# Altium schematic sheet Cannon_V2.SchDoc
size A3
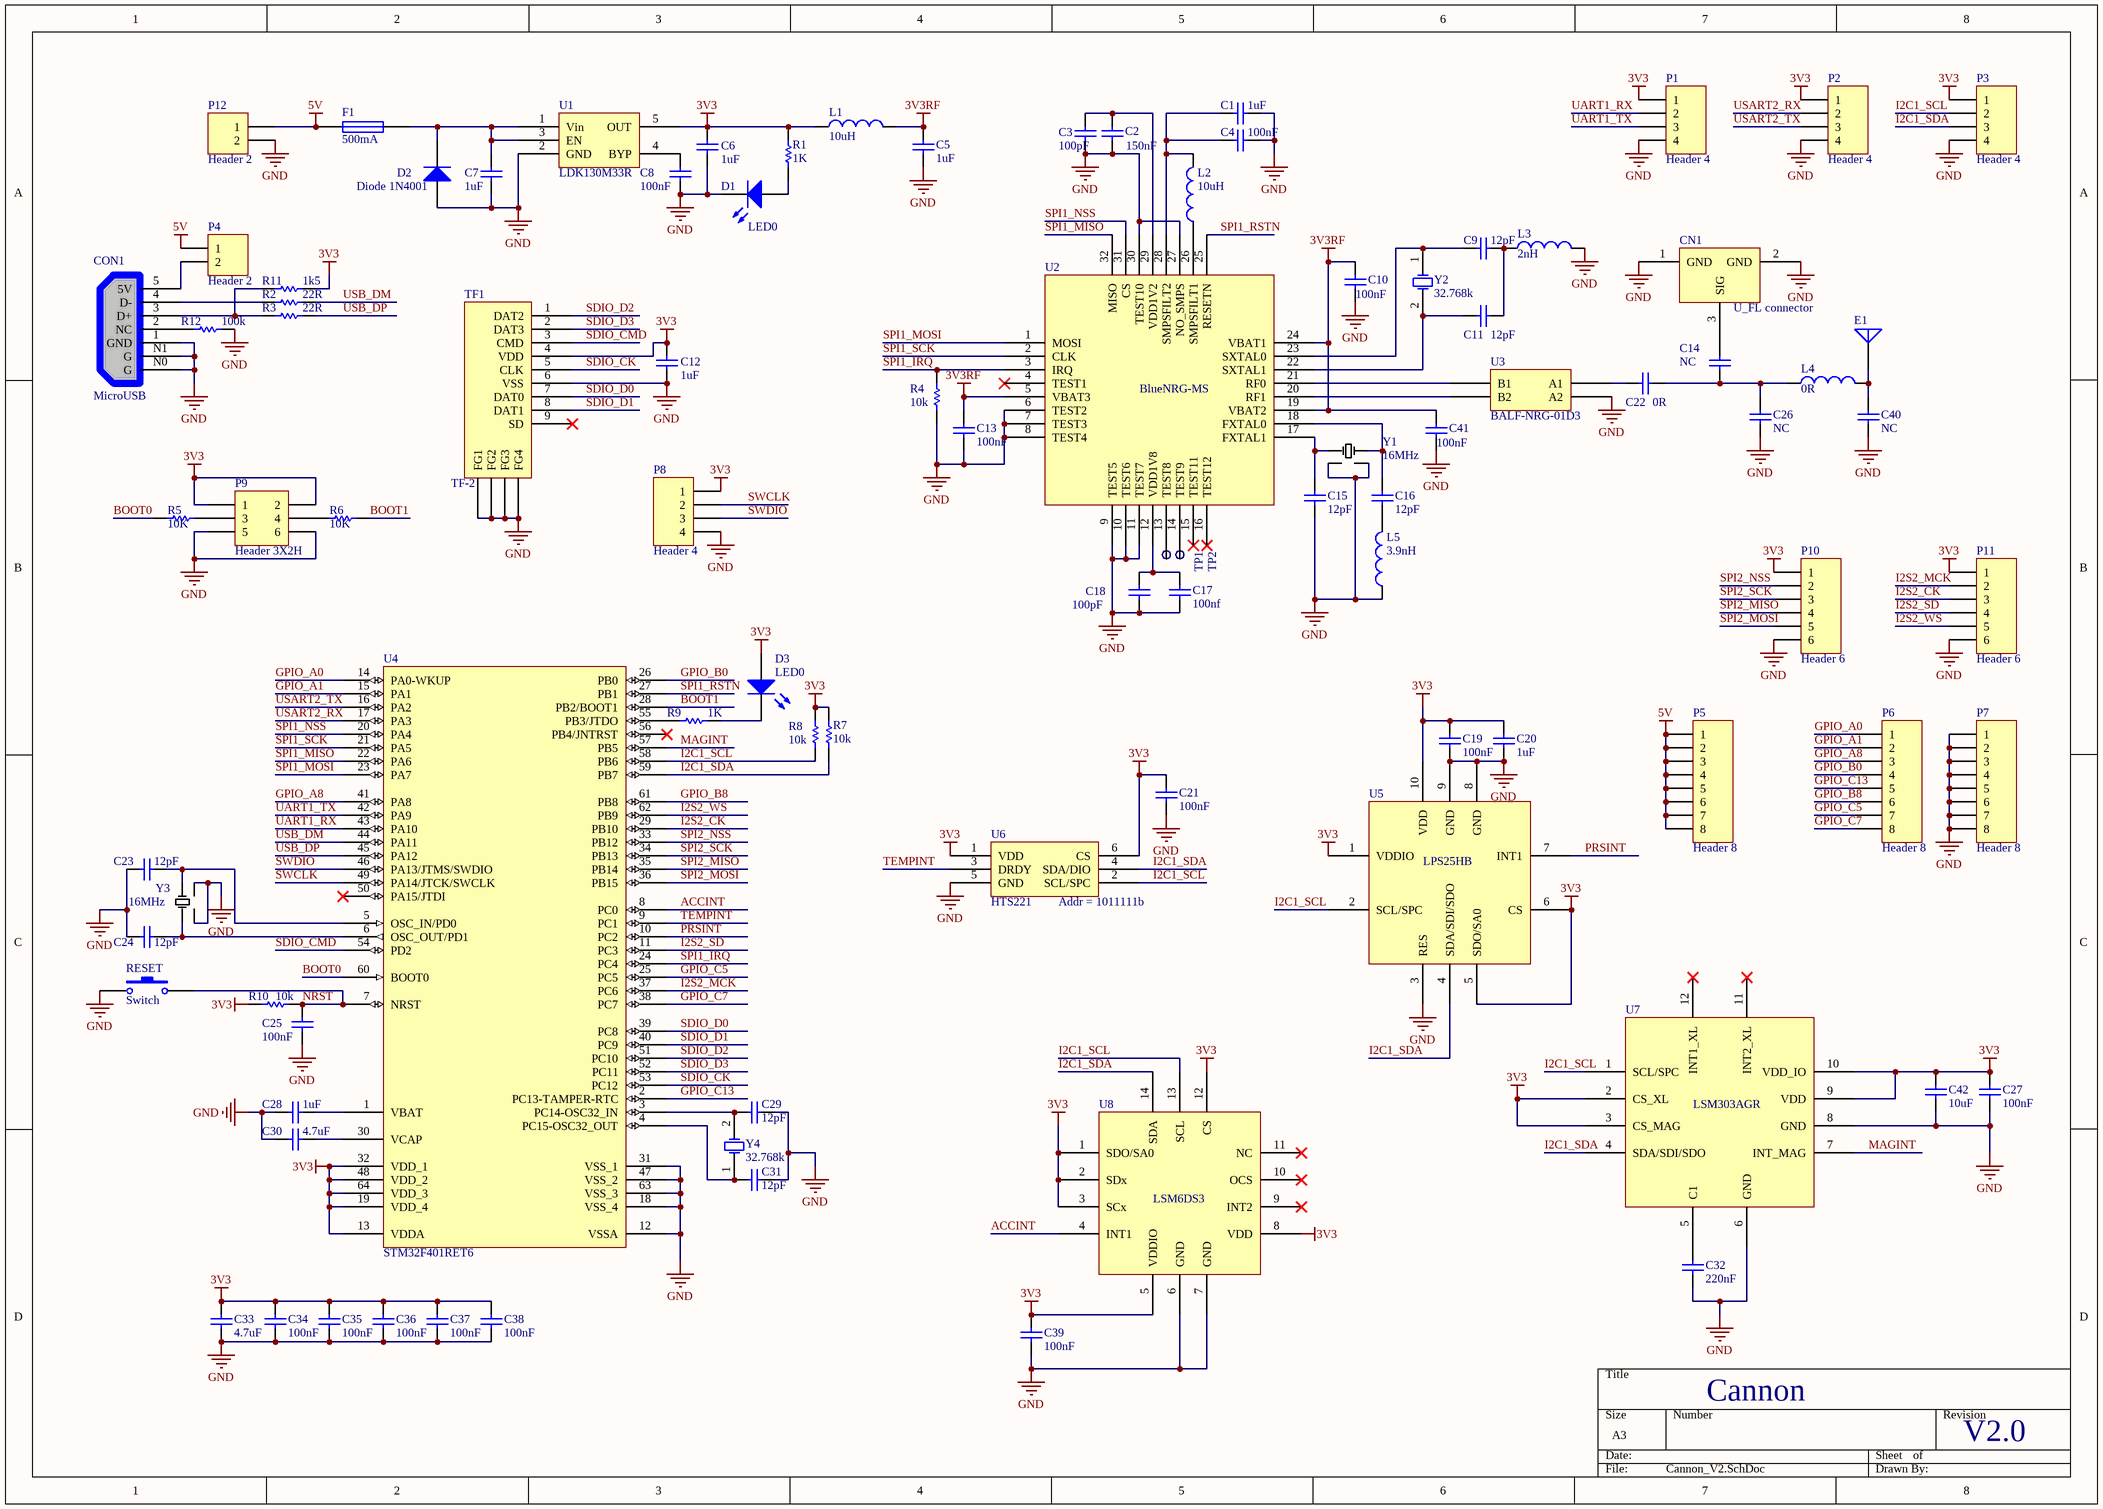
[diagram p0: Cannon_V2.SchDoc]

## Parts
C1  1uF  [CAPC1608X06L]
C2  150nF  [CAPC1005X04L]
C3  100pF  [CAPC1005X04L]
C4  100nF  [CAPC1005X04L]
C5  1uF  [CAPC1608X06L]
C6  1uF  [CAPC1608X06L]
C7  1uF  [CAPC1608X06L]
C8  100nF  [CAPC1005X04L]
C9  12pF  [CAPC1005X04L]
C10  100nF  [CAPC1005X04L]
C11  12pF  [CAPC1005X04L]
C12  1uF  [CAPC1608X06L]
C13  100nF  [CAPC1005X04L]
C14  NC  [CAPC1005X04L]
C15  12pF  [CAPC1005X04L]
C16  12pF  [CAPC1005X04L]
C17  100nf  [CAPC1005X04L]
C18  100pF  [CAPC1005X04L]
C19  100nF  [CAPC1005X04L]
C20  1uF  [CAPC1608X06L]
C21  100nF  [CAPC1005X04L]
C22  0R  [CAPC1005X04L]
C23  12pF  [CAPC1005X04L]
C24  12pF  [CAPC1005X04L]
C25  100nF  [CAPC1005X04L]
C26  NC  [CAPC1005X04L]
C27  100nF  [CAPC1005X04L]
C28  1uF  [CAPC1608X06L]
C29  12pF  [CAPC1005X04L]
C30  4.7uF  [CAPC1608X06L]
C31  12pF  [CAPC1005X04L]
C32  220nF  [CAPC1005X04L]
C33  4.7uF  [CAPC1608X06L]
C34  100nF  [CAPC1005X04L]
C35  100nF  [CAPC1005X04L]
C36  100nF  [CAPC1005X04L]
C37  100nF  [CAPC1005X04L]
C38  100nF  [CAPC1005X04L]
C39  100nF  [CAPC1005X04L]
C40  NC  [CAPC1005X04L]
C41  100nF  [CAPC1005X04L]
C42  10uF  [CAPC1608X06L]
CN1  U_FL connector  [UFL]
CON1  MicroUSB  [Micro_USB]
D1  LED0  [INDC1608L]
D2  Diode 1N4001  [SOD323]
D3  LED0  [INDC1608L]
E1  Antenna  [INDM9621X21N]  (value not drawn)
F1  500mA  [6-0805_N]
L1  10uH  [INDC1608X06L]
L2  10uH  [INDC1608X06L]
L3  2nH  [INDC1005X04L]
L4  0R  [INDC1005X04L]
L5  3.9nH  [INDC1005X04L]
P1  Header 4  [HDR1X4]
P2  Header 4  [HDR1X4]
P3  Header 4  [HDR1X4]
P4  Header 2  [HDR1X2]
P5  Header 8  [HDR1X8]
P6  Header 8  [HDR1X8]
P7  Header 8  [HDR1X8]
P8  Header 4  [HDR1X4]
P9  Header 3X2H  [HDR2X3]
P10  Header 6  [HDR1X6]
P11  Header 6  [HDR1X6]
P12  Header 2  [SIP_2]
R1  1K  [INDC1005X04L]
R2  22R  [INDC1005X04L]
R3  22R  [INDC1005X04L]
R4  10k  [INDC1005X04L]
R5  10K  [INDC1005X04L]
R6  10K  [INDC1005X04L]
R7  10k  [INDC1005X04L]
R8  10k  [INDC1005X04L]
R9  1K  [INDC1005X04L]
R10  10k  [INDC1005X04L]
R11  1k5  [INDC1005X04L]
R12  100k  [INDC1005X04L]
RESET  Switch  [SW_THT_4x4x1.5]
TF1  TF-2  [TF-2]
TP1  TP  [TP-1x1]  (value not drawn)
TP2  TP  [TP-1x1]  (value not drawn)
U1  LDK130M33R  [SOT23-5L]
U2  BlueNRG-MS  [QFN32]
U3  BALF-NRG-01D3  [BALF-PK]
U4  STM32F401RET6  [LQFP64_N]
U5  LPS25HB  [HLGA-10L]
U6  HTS221  [HLGA-6L]
U7  LSM303AGR  [LGA12]
U8  LSM6DS3  [LGA-14L]
Y1  16MHz  [3225]
Y2  32.768k  [XTAL_3215]
Y3  16MHz  [3225]
Y4  32.768k  [XTAL_3215]

## Nets
3V3: C6.2 C12.2 C19.2 C20.1 C21.2 C27.1 C33.2 C34.1 C35.1 C36.1 C37.1 C38.1 C39.1 C42.1 D3.2(A) L1.1 P1.1 P2.1 P3.1 P8.1 P9.1 P9.2 P10.1 P11.1 R1.1 R7.1 R8.1 R10.2 R11.2 TF1.4(VDD) U1.5(OUT) U4.13(VDDA) U4.19(VDD_4) U4.32(VDD_1) U4.48(VDD_2) U4.64(VDD_3) U5.1(VDDIO) U5.5(SDO/SA0) U5.6(CS) U5.10(VDD) U6.1(VDD) U6.6(CS) U7.2(CS_XL) U7.3(CS_MAG) U7.9(VDD) U7.10(VDD_IO) U8.1(SDO/SA0) U8.2(SDx) U8.3(SCx) U8.5(VDDIO) U8.8(VDD) U8.12(CS)
3V3RF: C5.1 C10.1 C13.1 C41.1 L1.2 U2.5(VBAT3) U2.19(VBAT2) U2.24(VBAT1)
5V: F1.2 P4.1 P5.1 P5.2 P5.3 P5.4 P5.5 P5.6 P5.7 P5.8 P12.1
GND: C1.2 C2.2 C3.2 C4.2 C5.2 C6.1 C7.1 C8.1 C10.2 C12.1 C13.2 C15.2 C17.2 C18.2 C19.1 C20.2 C21.1 C23.2 C24.2 C25.1 C26.1 C27.2 C28.2 C29.1 C30.2 C31.1 C32.1 C33.1 C34.2 C35.2 C36.2 C37.2 C38.2 C39.2 C40.1 C41.2 C42.2 CN1.1(GND) CN1.2(GND) CON1.1(GND) CON1.N0(G) CON1.N1(G) D1.1(K) D2.1(A) L3.2 L5.1 P1.4 P2.4 P3.4 P7.1 P7.2 P7.3 P7.4 P7.5 P7.6 P7.7 P7.8 P8.4 P9.5 P9.6 P10.6 P11.6 P12.2 R4.2 R12.2 RESET.1 TF1.6(VSS) TF1.FG1 TF1.FG2 TF1.FG3 TF1.FG4 U1.2(GND) U2.6(TEST2) U2.7(TEST3) U2.8(TEST4) U2.9(TEST5) U2.10(TEST6) U2.11(TEST7) U2.27(NO_SMPS) U2.30(TEST10) U3.A2 U4.12(VSSA) U4.18(VSS_4) U4.31(VSS_1) U4.47(VSS_2) U4.63(VSS_3) U5.3(RES) U5.8(GND) U5.9(GND) U6.5(GND) U7.6(GND) U7.8(GND) U8.6(GND) U8.7(GND) Y1.2 Y1.4 Y3.2 Y3.4
ACCINT: U4.8(PC0) U8.4(INT1)
BOOT0: R5.1 U4.60(BOOT0)
BOOT1: R6.2 U4.28(PB2/BOOT1)
GPIO_A0: P6.1 U4.14(PA0-WKUP)
GPIO_A1: P6.2 U4.15(PA1)
GPIO_A8: P6.3 U4.41(PA8)
GPIO_B0: P6.4 U4.26(PB0)
GPIO_B8: P6.6 U4.61(PB8)
GPIO_C5: P6.7 U4.25(PC5)
GPIO_C7: P6.8 U4.38(PC7)
GPIO_C13: P6.5 U4.2(PC13-TAMPER-RTC)
I2C1_SCL: P3.2 R8.2 U4.58(PB6) U5.2(SCL/SPC) U6.2(SCL/SPC) U7.1(SCL/SPC) U8.13(SCL)
I2C1_SDA: P3.3 R7.2 U4.59(PB7) U5.4(SDA/SDI/SDO) U6.4(SDA/DIO) U7.4(SDA/SDI/SDO) U8.14(SDA)
I2S2_CK: P11.3 U4.29(PB10)
I2S2_MCK: P11.2 U4.37(PC6)
I2S2_SD: P11.4 U4.11(PC3)
I2S2_WS: P11.5 U4.62(PB9)
MAGINT: U4.57(PB5) U7.7(INT_MAG)
NRST: C25.2 R10.1 RESET.2 U4.7(NRST)
PRSINT: U4.10(PC2) U5.7(INT1)
SDIO_CK: TF1.5(CLK) U4.53(PC12)
SDIO_CMD: TF1.3(CMD) U4.54(PD2)
SDIO_D0: TF1.7(DAT0) U4.39(PC8)
SDIO_D1: TF1.8(DAT1) U4.40(PC9)
SDIO_D2: TF1.1(DAT2) U4.51(PC10)
SDIO_D3: TF1.2(DAT3) U4.52(PC11)
SPI1_IRQ: R4.1 U2.3(IRQ) U4.24(PC4)
SPI1_MISO: U2.32(MISO) U4.22(PA6)
SPI1_MOSI: U2.1(MOSI) U4.23(PA7)
SPI1_NSS: U2.31(CS) U4.20(PA4)
SPI1_RSTN: U2.25(RESETN) U4.27(PB1)
SPI1_SCK: U2.2(CLK) U4.21(PA5)
SPI2_MISO: P10.4 U4.35(PB14)
SPI2_MOSI: P10.5 U4.36(PB15)
SPI2_NSS: P10.2 U4.33(PB12)
SPI2_SCK: P10.3 U4.34(PB13)
SWCLK: P8.2 U4.49(PA14/JTCK/SWCLK)
SWDIO: P8.3 U4.46(PA13/JTMS/SWDIO)
TEMPINT: U4.9(PC1) U6.3(DRDY)
UART1_RX: P1.2 U4.43(PA10)
UART1_TX: P1.3 U4.42(PA9)
USART2_RX: P2.2 U4.17(PA3)
USART2_TX: P2.3 U4.16(PA2)
USB_DM: R2.2 U4.44(PA11)
USB_DP: R3.2 U4.45(PA12)
NetC1_1: C1.1 C4.1 L2.2 U2.28(SMPSFILT2)
NetC2_1: C2.1 C3.1 U2.29(VDD1V2)
NetC7_2: C7.2 D2.2(K) F1.1 U1.1(Vin) U1.3(EN)
NetC8_2: C8.2 U1.4(BYP)
NetC9_1: C9.1 U2.23(SXTAL0) Y2.1(OSC1)
NetC9_2: C9.2 C11.2 L3.1
NetC11_1: C11.1 U2.22(SXTAL1) Y2.2(OSC2)
NetC14_1: C14.1 CN1.3(SIG)
NetC14_2: C14.2 C22.2 C26.2 L4.1
NetC15_1: C15.1 U2.17(FXTAL1) Y1.1
NetC16_1: C16.1 U2.18(FXTAL0) Y1.3
NetC16_2: C16.2 L5.2
NetC17_1: C17.1 C18.1 U2.12(VDD1V8)
NetC22_1: C22.1 U3.A1
NetC23_1: C23.1 U4.5(OSC_IN/PD0) Y3.3
NetC24_1: C24.1 U4.6(OSC_OUT/PD1) Y3.1
NetC28_1: C28.1 U4.1(VBAT)
NetC29_2: C29.2 U4.3(PC14-OSC32_IN) Y4.2(OSC2)
NetC30_1: C30.1 U4.30(VCAP)
NetC31_2: C31.2 U4.4(PC15-OSC32_OUT) Y4.1(OSC1)
NetC32_2: C32.2 U7.5(C1)
NetC40_2: C40.2 E1.1(A) L4.2
NetCON1_2: CON1.2(NC) R12.1
NetCON1_3: CON1.3(D+) R3.1 R11.1
NetCON1_4: CON1.4(D-) R2.1
NetCON1_5: CON1.5(5V) P4.2
NetD1_2: D1.2(A) R1.2
NetD3_1: D3.1(K) R9.2
NetL2_1: L2.1 U2.26(SMPSFILT1)
NetP9_3: P9.3 R5.2
NetP9_4: P9.4 R6.1
NetR9_1: R9.1 U4.55(PB3/JTDO)
NetTP1_1: TP1.1(TP) U2.13(TEST8)
NetTP2_1: TP2.1(TP) U2.14(TEST9)
NetU2_20: U2.20(RF1) U3.B2
NetU2_21: U2.21(RF0) U3.B1

Not connected (* = marked no-connect by the designer): TF1 9(SD)*; U2 4(TEST1)* 15(TEST11)* 16(TEST12)*; U4 50(PA15/JTDI)* 56(PB4/JNTRST)*; U7 11(INT2_XL)* 12(INT1_XL)*; U8 9(INT2)* 10(OCS)* 11(NC)*

## Notes on the sheet
- (near U6) Addr = 1011111b
- Cannon
- V2.0

## Library data of the parts
C1 C2 C4-C14 C17 C19-C42 = Cap: Capacitor; Value: 100pF; Published: 8-Jun-2000; LatestRevisionDate: 17-Jul-2002; LatestRevisionNote: Re-released for DXP Platform.; PackageReference: RAD-0.3; Publisher: Altium Limited; PackageDescription: Radial Cap, Thru-Hole; 2 Leads; 0.3 in Pin Spacing
C3 C18 = Cap: Capacitor; Published: 8-Jun-2000; LatestRevisionDate: 17-Jul-2002; LatestRevisionNote: Re-released for DXP Platform.; PackageReference: RAD-0.3; Publisher: Altium Limited; PackageDescription: Radial Cap, Thru-Hole; 2 Leads; 0.3 in Pin Spacing; Value: 100pF
C15 C16 = Cap Semi: Published: 8-Jun-2000; LatestRevisionDate: 29-May-2009; LatestRevisionNote: IPC-7351 Footprint Added.; PackageReference: C1206; Publisher: Altium Limited; PackageDescription: Chip Capacitor; Value: 12pF
CON1 = MicroUSB_A
D1 D3 = LED0: Typical INFRARED GaAs LED; Published: 8-Jun-2000; LatestRevisionDate: 08-Jul-2005; LatestRevisionNote: Mech Layer 1 removed.; PackageReference: LED-0; Publisher: Altium Limited; PackageDescription: LED; 2 Leads
D2 = Diode 1N4001: 1 Amp General Purpose Rectifier; Published: 8-Jun-2000; LatestRevisionDate: 17-Jul-2002; LatestRevisionNote: Re-released for DXP Platform.; DatasheetVersion: 1998; PackageVersion: Aug-1999; PackageReference: DO-41; Publisher: Altium Limited; PackageDescription: Diode, Axial; Body 5.2 x 2.7 mm (LxDia. max), Lead Dia. 0.86 mm (max); Code_JEDEC: DO-204-AL; ComponentLink1Description: Manufacturer Link; ComponentLink1URL: http://www.fairchildsemi.com/; ComponentLink2Description: Datasheet; ComponentLink2URL: http://www.fairchildsemi.com/ds/1N%2F1N4001.pdf
E1 = Antenna: Generic Antenna; Published: 24-Mar-1999; LatestRevisionDate: 17-Jul-2002; LatestRevisionNote: Re-released for DXP Platform.; PackageReference: PIN1; Publisher: Altium Limited
F1 = Fuse 1: Fuse; Published: 8-Jun-2000; LatestRevisionDate: 17-Jul-2002; LatestRevisionNote: Re-released for DXP Platform.; PackageReference: PIN-W2/E2.8; Publisher: Altium Limited; PackageDescription: Thru-Hole; 2 Leads
L1 L2 = Inductor: Code_IEC: 1005; Published: 8-Jun-2000; LatestRevisionDate: 29-May-2009; LatestRevisionNote: IPC-7351 Footprint Added.; PackageReference: 0402-A; Publisher: Altium Limited; PackageDescription: Chip Inductor; Code_JEITA: 0402; Value: 10uH
L3-L5 = Inductor: Code_IEC: 1005; Value: 10uH; Published: 8-Jun-2000; LatestRevisionDate: 29-May-2009; LatestRevisionNote: IPC-7351 Footprint Added.; PackageReference: 0402-A; Publisher: Altium Limited; PackageDescription: Chip Inductor; Code_JEITA: 0402
P1-P3 P8 = Header 4: Header, 4-Pin; LatestRevisionDate: 17-Jul-2002; LatestRevisionNote: Re-released for DXP Platform.; Publisher: Altium Limited
P4 P12 = Header 2: Header, 2-Pin; LatestRevisionDate: 17-Jul-2002; LatestRevisionNote: Re-released for DXP Platform.; Publisher: Altium Limited
P5-P7 = Header 8: Header, 8-Pin; LatestRevisionDate: 17-Jul-2002; LatestRevisionNote: Re-released for DXP Platform.; Publisher: Altium Limited
P9 = Header 3X2H: Header, 3-Pin, Dual row, Right Angle; LatestRevisionDate: 17-Jul-2002; LatestRevisionNote: Re-released for DXP Platform.; Publisher: Altium Limited
P10 P11 = Header 6: Header, 6-Pin; LatestRevisionDate: 17-Jul-2002; LatestRevisionNote: Re-released for DXP Platform.; Publisher: Altium Limited
R1 R9 = Res1: Resistor; Published: 8-Jun-2000; LatestRevisionDate: 17-Jul-2002; LatestRevisionNote: Re-released for DXP Platform.; PackageReference: AXIAL-0.3; Publisher: Altium Limited; PackageDescription: Axial Device, Thru-Hole; 2 Leads; 0.3 in Pin Spacing; Value: 1K
R2-R8 R10-R12 = Res1: Resistor; Value: 1K; Published: 8-Jun-2000; LatestRevisionDate: 17-Jul-2002; LatestRevisionNote: Re-released for DXP Platform.; PackageReference: AXIAL-0.3; Publisher: Altium Limited; PackageDescription: Axial Device, Thru-Hole; 2 Leads; 0.3 in Pin Spacing
RESET = SW THT 6x6x5: Micro miniature pushbutton surface Switch; Manufacturer: Würth; OrderingCode: 430 186 050 716; Temp_ Max: 85; Temp_ Min: -40; Part Number: SW THT 6x6x5; Price (€): 0,058
U4 = STM32F401RET6: STM32 ARM-based 32-bit MCU with 256 Kbytes Flash, 64-pin LQFP, Industrial Temperature; Published: 30-May-2008; DatasheetVersion: rev6, Mar-2008; PackageVersion: Mar-2008; PackageReference: LQFP64; Publisher: Altium Limited; PackageDescription: 64-Pin Low-Profile Quad Flat Pack, 10 x 10 mm Body, 0.5 mm Pitch (LQFP64); ComponentLink1Description: Manufacturer Link; ComponentLink1URL: www.st.com/stm32; ComponentLink2Description: Datasheet; ComponentLink2URL: http://www.st.com/stonline/products/literature/ds/13586.pdf
U5 = LPS25H
Y1 Y3 = 3225
Y2 Y4 = XTAL: Crystal Oscillator; Published: 8-Jun-2000; LatestRevisionDate: 17-Jul-2002; LatestRevisionNote: Re-released for DXP Platform.; PackageReference: R38; Publisher: Altium Limited; PackageDescription: Crystal, Thru-Hole; 2 Leads; Body 3.1 x 8.2 mm (Dia.xH)